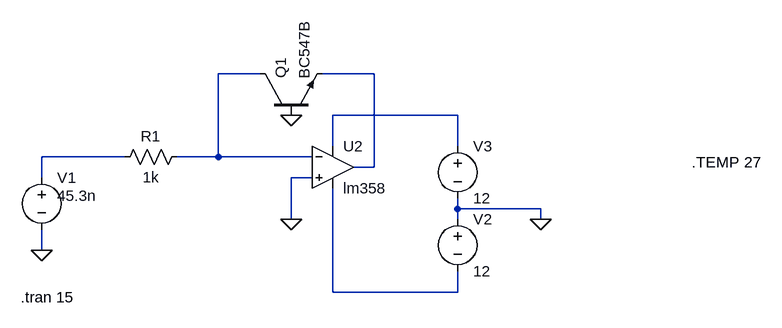
[diagram p0: schematic LogBJT.asc]
LogBJT.asc, the LTspice schematic file:
Version 4
SHEET 1 880 680
WIRE 80 -176 16 -176
WIRE 256 -176 176 -176
WIRE 384 -112 192 -112
WIRE 192 -64 192 -112
WIRE 384 -64 384 -112
WIRE -128 -48 -256 -48
WIRE 16 -48 16 -176
WIRE 16 -48 -48 -48
WIRE 160 -48 16 -48
WIRE 256 -32 256 -176
WIRE 256 -32 224 -32
WIRE -256 -16 -256 -48
WIRE 160 -16 128 -16
WIRE 384 32 384 16
WIRE 512 32 384 32
WIRE 128 48 128 -16
WIRE 384 48 384 32
WIRE 512 48 512 32
WIRE -256 96 -256 64
WIRE 192 160 192 0
WIRE 384 160 384 128
WIRE 384 160 192 160
FLAG -256 96 0
FLAG 512 48 0
FLAG 128 48 0
FLAG 128 -112 0
SYMBOL voltage -256 -32 R0
WINDOW 3 24 44 Left 2
WINDOW 123 0 0 Left 0
WINDOW 39 0 0 Left 0
SYMATTR Value 45.3n
SYMATTR InstName V1
SYMBOL voltage 384 32 R0
WINDOW 123 0 0 Left 0
WINDOW 39 0 0 Left 0
SYMATTR InstName V2
SYMATTR Value 12
SYMBOL voltage 384 -80 R0
WINDOW 123 0 0 Left 0
WINDOW 39 0 0 Left 0
SYMATTR InstName V3
SYMATTR Value 12
SYMBOL res -32 -64 R90
WINDOW 0 0 56 VBottom 2
WINDOW 3 32 56 VTop 2
SYMATTR InstName R1
SYMATTR Value 1k
SYMBOL npn 80 -112 R270
SYMATTR InstName Q1
SYMATTR Value BC547B
SYMBOL OpAmps\\lm358 192 -96 R0
SYMATTR InstName U2
TEXT -288 168 Left 2 !.tran 15
TEXT 744 -40 Left 2 !.TEMP 27

The netlist it stands for:
* LogBJT.asc
V1 N004 0 45.3n
V2 0 N005 12
V3 N003 0 12
R1 N001 N004 1k
Q1 N001 0 N002 0 BC547B
XU2 0 N001 N003 N005 N002 lm358  ; pins In+ In- V+ V- OUT
.model NPN NPN
.model PNP PNP
.lib standard.bjt
.tran 15
.TEMP 27
.backanno
.end